# EAGLE design TM1638_on_ATtiny841 (EAGLE 7.5.0)
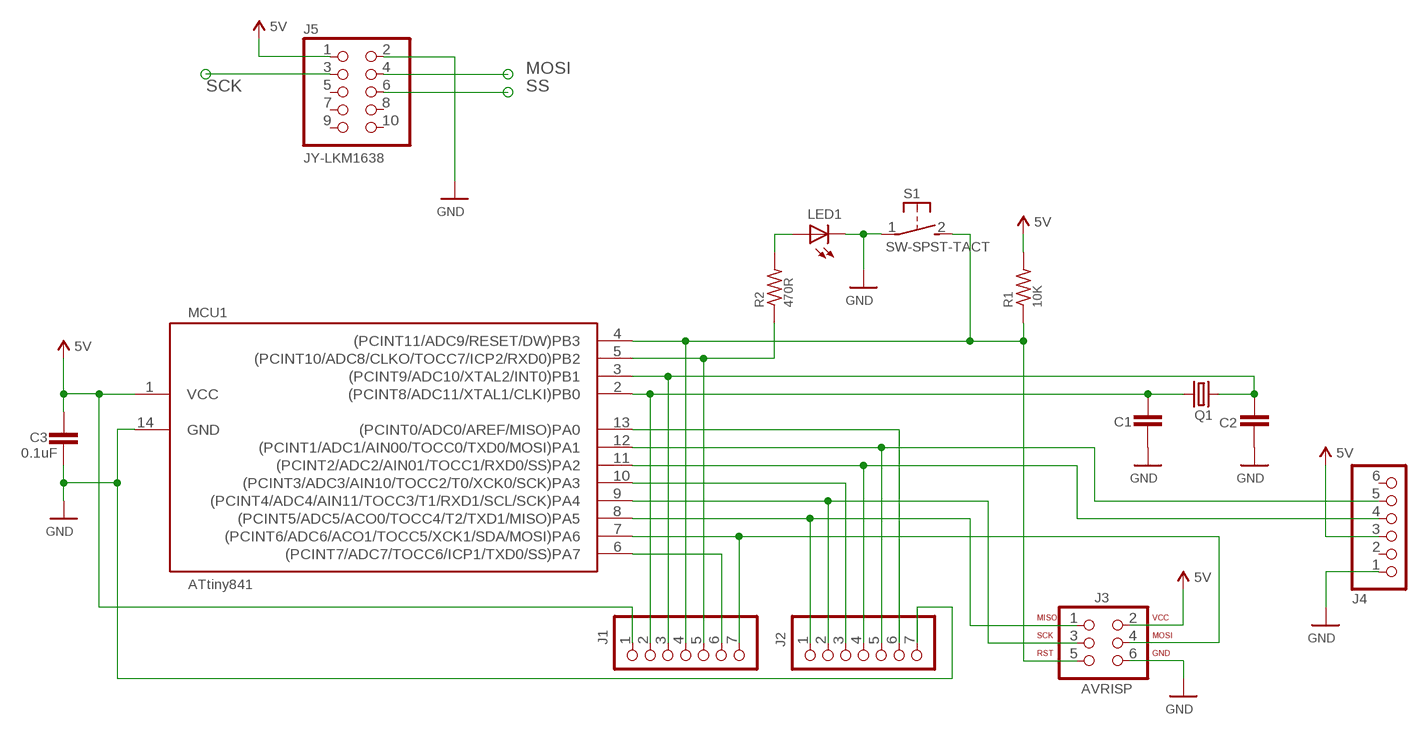
[diagram p0: schematic, sheet 1]

## Parts
C1  C-UNPOL  [CAP-PTH-SMALL2]
C2  C-UNPOL  [CAP-PTH-SMALL2]
C3  0.1uF  C-UNPOL  [CAP-PTH-SMALL2]
J1  PINHD-1X71X07-CLEANBIG  [1X07-CLEANBIG]
J2  PINHD-1X71X07-CLEANBIG  [1X07-CLEANBIG]
J3  AVRISP  [2X03-CLEAN]
J4  PINHD-1X6CB  [1X06-CLEANBIG]
J5  JY-LKM1638  PINHD-2X5  [2X05]
LED1  LED5MM  [LED5MM]
MCU1  ATtiny841  ATTINY441/841-SSU  [SOIC14]
Q1  CRYSTALHC49S  [HC49/S]
R1  10K  RESISTOR-0207/V  [RESISTOR-0207/2V]
R2  470R  RESISTOR-0207/V  [RESISTOR-0207/2V]
S1  SW-SPST-TACT  [DTS-3]

## Nets
5V: C3.1 J1.1 J3.2 J4.3 J5.1 MCU1.1(VCC) R1.2
GND: C1.2 C2.1 C3.2 J2.7 J3.6 J4.1 J5.2 LED1.K(C) MCU1.14(GND) S1.1
MISO: J2.1 J3.1 MCU1.8((PCINT5/ADC5/ACO0/TOCC4/T2/TXD1/MISO)PA5)
MOSI: J1.7 J3.4 J5.4 MCU1.7((PCINT6/ADC6/ACO1/TOCC5/XCK1/SDA/MOSI)PA6)
N$2: C1.1 J1.2 MCU1.2((PCINT8/ADC11/XTAL1/CLKI)PB0) Q1.1
N$3: C2.2 J1.3 MCU1.3((PCINT9/ADC10/XTAL2/INT0)PB1) Q1.2
N$4: J2.6 MCU1.13((PCINT0/ADC0/AREF/MISO)PA0)
N$5: J2.3 MCU1.10((PCINT3/ADC3/AIN10/TOCC2/T0/XCK0/SCK)PA3)
N$10: J1.5 MCU1.5((PCINT10/ADC8/CLKO/TOCC7/ICP2/RXD0)PB2) R2.1
N$11: LED1.A R2.2
RST: J1.4 J3.5 MCU1.4((PCINT11/ADC9/RESET/DW)PB3) R1.1 S1.2
RTS: J2.5 J4.5 MCU1.12((PCINT1/ADC1/AIN00/TOCC0/TXD0/MOSI)PA1)
RXD0: J2.4 J4.4 MCU1.11((PCINT2/ADC2/AIN01/TOCC1/RXD0/SS)PA2)
SCK: J2.2 J3.3 J5.3 MCU1.9((PCINT4/ADC4/AIN11/TOCC3/T1/RXD1/SCL/SCK)PA4)
SS: J1.6 J5.6 MCU1.6((PCINT7/ADC7/TOCC6/ICP1/TXD0/SS)PA7)
Unconnected: J4.2 J4.6 J5.5 J5.7 J5.8 J5.9 J5.10

## Notes on the sheet
- MOSI
- SCK | SS

## Library data of the parts
C1-C3 = AU2016:C-UNPOL
J1 J2 = AU2016:PINHD-1X7
J3 = AU2016:AVRISP
J4 = AU2016:PINHD-1X6: PIN HEADER
J5 = AU2016:PINHD-2X5: PIN HEADER
LED1 = AU2016:LED: LED OSRAM: - CHIPLED LG R971, LG N971, LY N971, LG Q971, LY Q971, LO R971, LY R971 LH N974, LH R974 LS Q976, LO Q976, LY Q976 LO Q996 - Hyper CHIPLED LW Q18S LB Q993, LB Q99A, LB R99A - SideLED LS A670, LO A670, LY A670, LG A670, LP A670 LB A673, LV A673, LT A673, LW A673 LH A674 LY A675 LS A676, LA A676, LO A676, LY A676, LW A676 LS A679, LY A679, LG A679 - Hyper Micro SIDELED® LS Y876, LA Y876, LO Y876, LY Y876 LT Y87S - SmartLED LW L88C, LW L88S LB L89C, LB L89S, LG L890 LS L89K, LO L89K, LY L89K LS L896, LA L896, LO L896, LY L896 - TOPLED LS T670, LO T670, LY T670, LG T670, LP T670 LSG T670, LSP T670, LSY T670, LOP T670, LYG T670 LG T671, LOG T671, LSG T671 LB T673, LV T673, LT T673, LW T673 LH T674 LS T676, LA T676, LO T676, LY T676, LB T676, LH T676, LSB T676, LW T676 LB T67C, LV T67C, LT T67C, LS T67K, LO T67K, LY T67K, LW E67C LS E67B, LA E67B, LO E67B, LY E67B, LB E67C, LV E67C, LT E67C LW T67C LS T679, LY T679, LG T679 LS T770, LO T770, LY T770, LG T770, LP T770 LB T773, LV T773, LT T773, LW T773 LH T774 LS E675, LA E675, LY E675, LS T675 LS T776, LA T776, LO T776, LY T776, LB T776 LHGB T686 LT T68C, LB T68C - Hyper Mini TOPLED® LB M676 - Mini TOPLED Santana® LG M470 LS M47K, LO M47K, LY M47K Source: http://www.osram.convergy.de/
MCU1 = AU2016:ATTINY441/841: ATtiny441, ATtiny841 AVR Microcontroller The high-performance Atmel picoPower 8-bit AVR RISC-based microcontroller combines 4KB ISP flash memory, 512-Byte EEPROM, 128B SRAM, 12 general purpose I/O lines, 32 general purpose working registers, an 8-bit timer/counter with two PWM channels, two 16-bit timer/counters with two PWM channels, internal and external interrupts, an 12-channel 10-bit A/D converter, 2 On-chip analog comparators, 2 full duplex USARTs with Start Frame wake up from power down, master/slave SPI serial interface, slave I2C serial interface, programmable gain stage (1x, 20x, and 100x) for 12 differential ADC channel pairs, programmable watchdog timer with internal oscillator, internal calibrated oscillator, and four software selectable power saving modes. The device operates between 1.7-5.5 volts. datasheet.pdf <http://www.atmel.com/Images/Atmel-8495-8-bit-AVR-Microcontrollers-ATtiny441-ATtiny841_Datasheet.pdf>
Q1 = AU2016:CRYSTAL: CRYSTAL; OC_FARNELL: 1667008; OC_NEWARK: unknown
R1 R2 = AU2016:RESISTOR-0207/V
S1 = AU2016:SW-SPST-TACT: SPST Tactile Switch Panasonic EVQ-PE504K 12V 0.05A Digikey P13589S-ND ($0.45 ea)

## Board
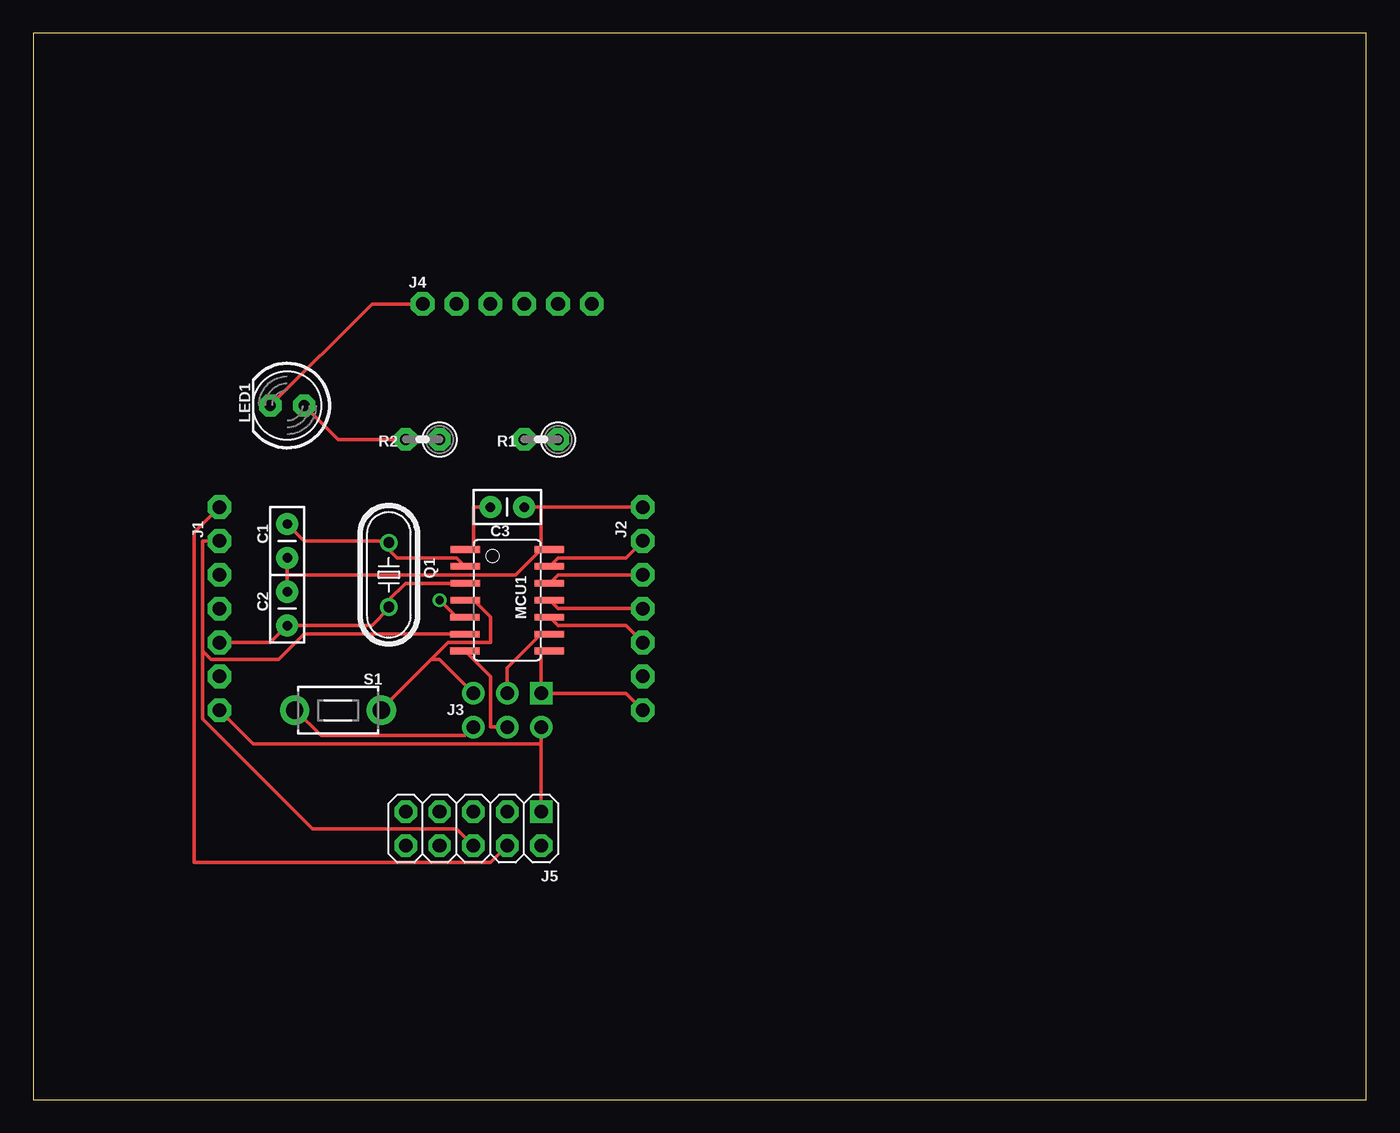
[diagram p1: board, top side]
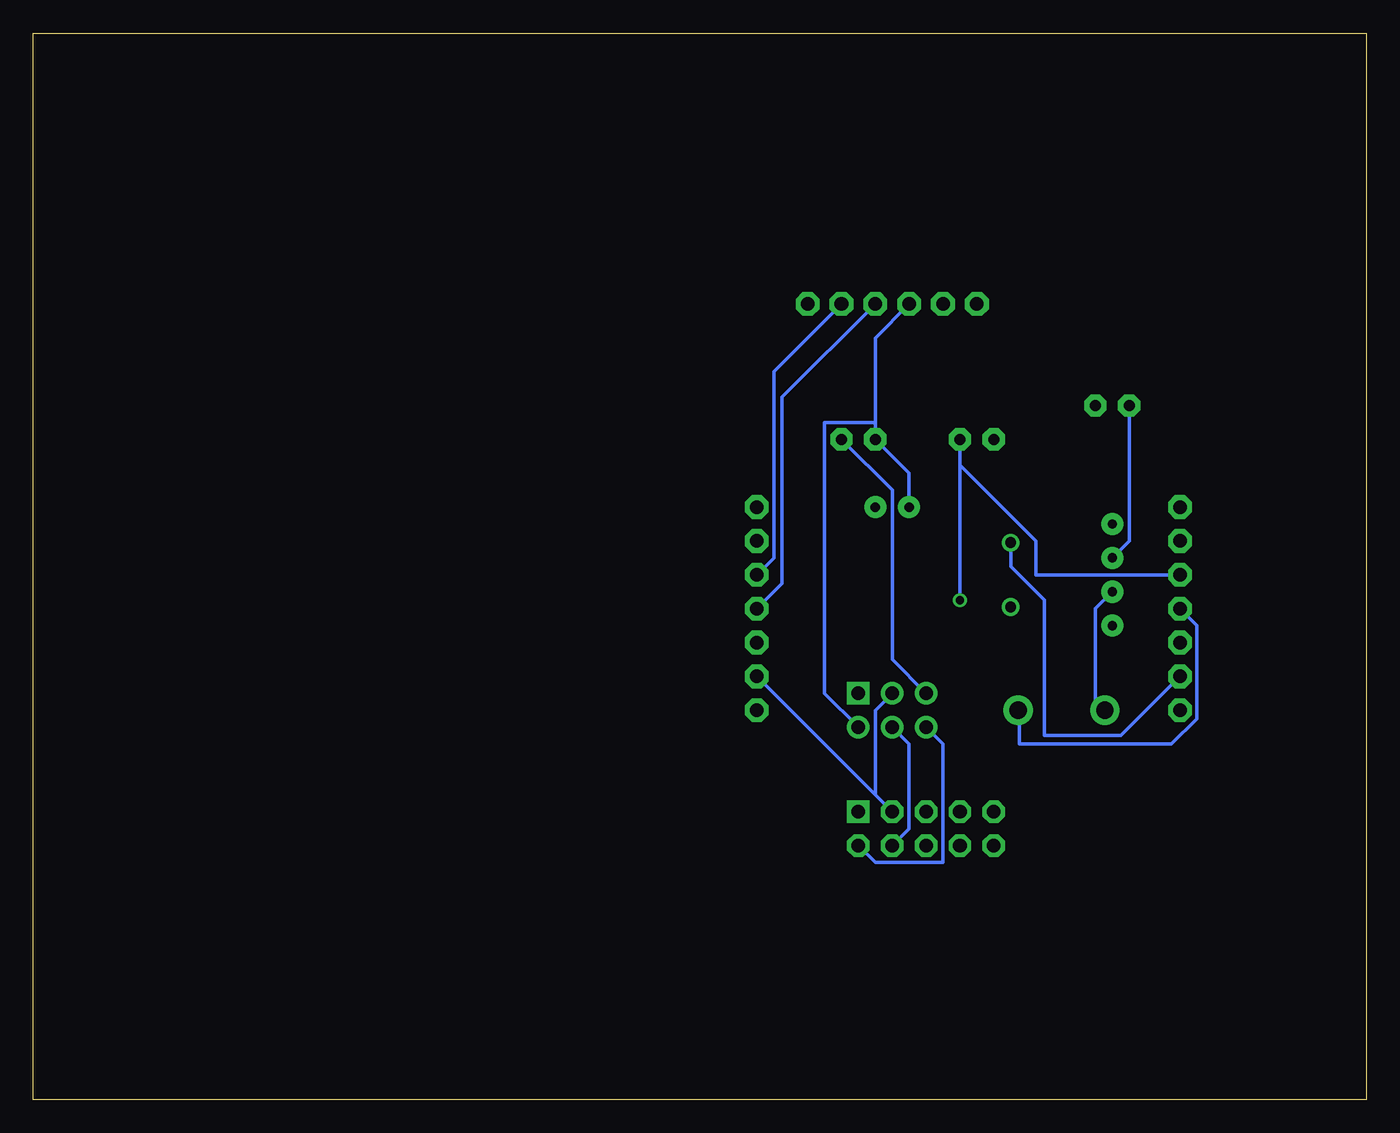
[diagram p2: board, bottom side, seen from below]

Size 100 x 80 mm. Coordinates in mm from the lower left corner, seen from the top.
Outline: 0,0 100,0 100,80 0,80 0,0
Copper layers (1*16): Top 0.035mm / dielectric 1.5mm / Bottom 0.035mm
Design rules "default": minimum track width 10mil, minimum drill 24mil, track to track 8mil, track to pad 8mil, pad to pad 8mil, via to via 8mil, smd to smd 8mil, copper to edge 40mil, drill to drill 8mil, minimum pad ring 10mil, minimum via ring 8mil, stop-mask expansion 4mil, vias tented up to drill 0mil, thermal gap 10mil

### Footprints (pad centres in the part's own frame; a part is rotated, then mirrored left to right if it is on the bottom)
CAP-PTH-SMALL2 = drill 0.7 pad 1.651: 1 0,0; 2 2.54,0
1X07-CLEANBIG = drill 1.016 pad 1.778 octagon: 1 -6.35,0; 2 -3.81,0; 3 -1.27,0; 4 1.27,0; 5 3.81,0; 6 6.35,0; 7 8.89,0
2X03-CLEAN = drill 1.016 pad 1.676 square: 1 -1.27,2.54 | drill 1.016 pad 1.676: 2 1.27,2.54; 3 -1.27,0; 4 1.27,0; 5 -1.27,-2.54; 6 1.27,-2.54
1X06-CLEANBIG = drill 1.016 pad 1.778 octagon: 1 -6.35,0; 2 -3.81,0; 3 -1.27,0; 4 1.27,0; 5 3.81,0; 6 6.35,0
2X05 = drill 1.016 pad 1.676 square: 1 -3.81,-1.27 | drill 1.016 pad 1.676 octagon: 2 -3.81,1.27; 3 -1.27,-1.27; 4 -1.27,1.27; 5 1.27,-1.27; 6 1.27,1.27; 7 3.81,-1.27; 8 3.81,1.27; 9 6.35,-1.27; 10 6.35,1.27
LED5MM = drill 0.813 pad 1.676 octagon: A -1.27,0; K 1.27,0
SOIC14 = smd 0.5 x 2.2: 1 -1.905,-3.154; 2 -0.645,-3.154; 3 0.625,-3.154; 4 1.895,-3.154; 5 3.175,-3.196; 6 4.445,-3.196; 7 5.715,-3.196; 8 5.715,3.154; 9 4.445,3.154; 10 3.175,3.154; 11 1.905,3.154; 12 0.635,3.154; 13 -0.635,3.154; 14 -1.905,3.154
HC49/S = drill 0.813: 1 -2.413,0; 2 2.413,0
RESISTOR-0207/2V = drill 0.813 pad 1.676 octagon: 1 -1.27,0; 2 1.27,0
DTS-3 = drill 1.3 pad 2.184: 1 -3.25,0; 2 3.25,0

### Placement (x,y rotation side)
C1  19.05,43.18 270 top
C2  19.05,38.1 270 top
C3  34.29,44.45 0 top
J1  13.97,35.56 90 top
J2  45.72,35.56 90 top
J3  35.56,29.21 270 top
J4  35.56,59.69 0 top
J5  34.29,20.32 180 top
LED1  19.05,52.07 180 top
MCU1  35.56,39.37 270 top
Q1  26.67,39.37 270 top
R1  38.1,49.53 180 top
R2  29.21,49.53 180 top
S1  22.86,29.21 0 top

### Tracks (layer width: path | path; a pad name or v marks a point on that pad's centre or on a via)
5V
  Top 0.254: C3.1 33.02,44.45 33.02,41.27 MCU1.1 | J3.2 38.1,26.67 | 38.1,26.67 J5.1 | J1.1 16.51,26.67 38.1,26.67
  Bottom 0.254: C3.1 34.29,46.99 R1.2 36.83,50.8 | J4.3 36.83,57.15 36.83,50.8 | 36.83,50.8 40.64,50.8 40.64,30.48 J3.2
GND
  Top 0.254: J3.6 32.38,27.3 21.59,27.3 19.68,29.21 S1.1 | 38.1,44.45 38.1,41.27 | C3.2 38.1,44.45 | 38.1,44.45 J2.7 | C1.2 19.05,39.37 | 19.05,39.37 C2.1 | LED1.K 25.4,59.69 J4.1 | 38.1,41.27 36.2,39.37 19.05,39.37 | 38.1,41.27 MCU1.14
  Bottom 0.254: J5.2 36.83,17.78 31.75,17.78 31.75,26.67 J3.6 | C1.2 17.78,41.91 LED1.K | C2.1 20.32,36.83 20.32,29.84 19.68,29.21 S1.1
MISO
  Top 0.254: MCU1.8 38.1,33.66 J3.1 44.45,30.48 J2.1
MOSI
  Top 0.254: J3.4 34.29,27.94 34.29,31.75 32.38,33.66 MCU1.7 | J1.7 12.06,42.55 12.06,17.78 34.29,17.78 J5.4
  Bottom 0.254: J5.4 34.29,20.32 34.29,26.67 J3.4
N$2
  Top 0.254: MCU1.2 32.38,40.01 31.75,40.64 27.3,40.64 26.67,41.27 Q1.1 26.67,41.91 20.32,41.91 C1.1
  Bottom 0.254: J1.2 18.41,27.3 24.13,27.3 24.13,37.47 26.67,40.01 Q1.1
N$3
  Top 0.254: MCU1.3 32.38,38.73 27.94,38.73 26.67,37.47 Q1.2 26.67,36.83 25.4,35.56 C2.2 17.78,34.29 J1.3
N$4
  Top 0.254: J2.6 44.45,40.64 39.37,40.64 38.73,40.01 MCU1.13
N$5
  Top 0.254: J2.3 44.45,35.56 39.37,35.56 38.73,36.2 MCU1.10
N$10  (via drill 0.61)
  Top 0.254: v30.48,37.47 31.75,36.2 MCU1.5
  Bottom 0.254: R2.1 30.48,47.62 | 30.48,47.62 v30.48,37.47 | J1.5 24.77,39.37 24.77,41.91 30.48,47.62
N$11
  Top 0.254: LED1.A 22.86,49.53 R2.2
RST
  Top 0.254: 29.84,33.02 26.04,29.21 S1.2 | 29.84,33.02 31.11,34.29 34.29,34.29 34.29,36.2 33.02,37.47 MCU1.4 | J3.5 30.48,33.02 29.84,33.02
  Bottom 0.254: R1.1 35.56,45.72 35.56,33.02 J3.5 | J1.4 12.7,35.56 12.7,28.57 14.61,26.67 26.04,26.67 26.04,29.21 S1.2
RTS
  Top 0.254: J2.5 39.37,39.37 38.73,38.73 MCU1.12
  Bottom 0.254: J4.5 44.45,54.61 44.45,40.64 J2.5
RXD0
  Top 0.254: J2.4 39.37,36.83 38.73,37.47 MCU1.11
  Bottom 0.254: J4.4 43.81,52.7 43.81,38.73 J2.4
SCK
  Top 0.254: J3.3 35.56,32.38 38.1,34.92 MCU1.9
  Bottom 0.254: J2.2 36.83,22.86 | 36.83,22.86 J5.3 | J3.3 36.83,29.21 36.83,22.86
SS
  Top 0.254: MCU1.6 20.32,34.92 18.41,33.02 13.34,33.02 12.7,33.66 | 12.7,33.66 12.7,41.91 J1.6 | J5.6 31.75,20.32 20.95,20.32 12.7,28.57 12.7,33.66